# EAGLE schematic iomodul3 (EAGLE 6.6.0)
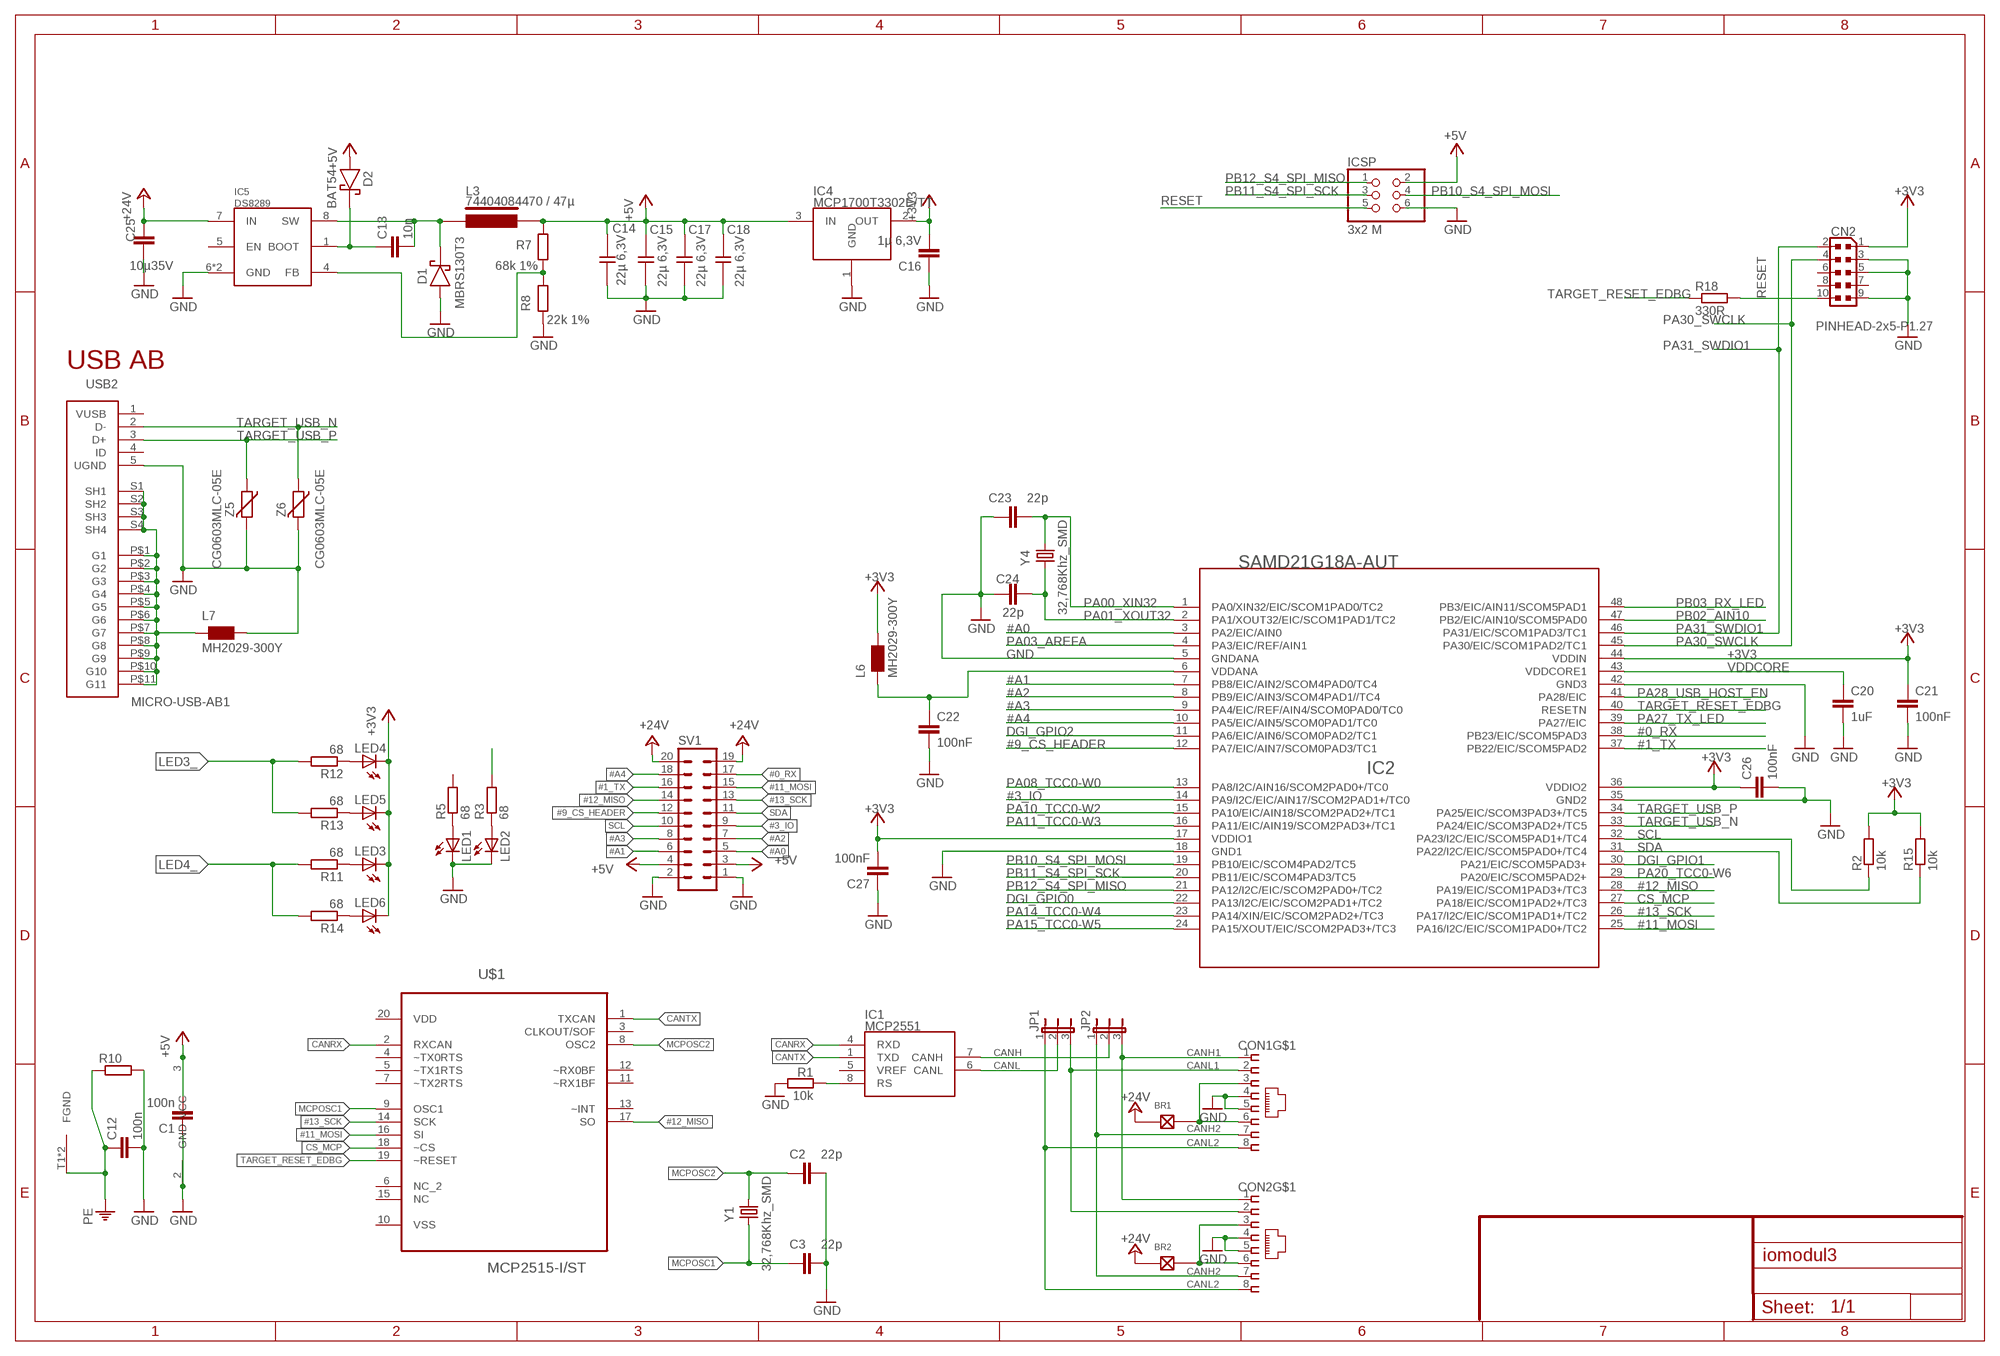
[diagram p0: schematic, sheet 1]

## Parts
BR1  LÖTBRÜCKE-S  [LÖTBRÜCKE]
BR2  LÖTBRÜCKE-S  [LÖTBRÜCKE]
C1  100n  C-EUC0805  [C0805]
C2  22p  C-EUC0805  [C0805]
C3  22p  C-EUC0805  [C0805]
C12  100n  C-EUC0805  [C0805]
C13  10n  C-EUC0805  [C0805]
C14  22µ 6,3V  CAP1210  [1210]
C15  22µ 6,3V  CAP1210  [1210]
C16  1µ 6,3V  C-EUC1206  [C1206]
C17  22µ 6,3V  CAP1210  [1210]
C18  22µ 6,3V  CAP1210  [1210]
C20  1uF  C-EUC0805  [C0805]
C21  100nF  C-EUC0805  [C0805]
C22  100nF  C-EUC0805  [C0805]
C23  22p  C-EUC0805  [C0805]
C24  22p  C-EUC0805  [C0805]
C25  10µ35V  C-EUC0805  [C0805]
C26  100nF  C-EUC0805  [C0805]
C27  100nF  C-EUC0805  [C0805]
CN2  PINHEAD-2x5-P1.27  0171_PH127-205DF055G00A  [PINHEAD-2X5-P127]
CON1  MEBP_8-8G  [MEBP]
CON2  MEBP_8-8G  [MEBP]
D1  MBRS130T3  [SMB]
D2  BAT54  [SOT23/32]
IC1  MCP2551  [SO-8]
IC2  SAMD21G18A-AUT  1792_SAMD21G18A-AUT  [TQFP48-7X7]
IC4  MCP1700T3302E/TT  MCP1700  [SOT23]
IC5  DS8289  [SO8-POWERPAD]
ICSP  3x2 M  0114_PH254-203DF118A00V  [2X03]
JP1  JP2E  [JP2]
JP2  JP2E  [JP2]
L3  74404084470 / 47µ  WE-LQS  [WE-LQS]
L6  MH2029-300Y  0001_BLM21PG300SN1D_/_MH2029-300Y  [0805]
L7  MH2029-300Y  0001_BLM21PG300SN1D_/_MH2029-300Y  [0805]
LED1  LEDCHIPLED_0805  [CHIPLED_0805]
LED2  LEDCHIPLED_0805  [CHIPLED_0805]
LED3  LEDCHIPLED_0805  [CHIPLED_0805]
LED4  LEDCHIPLED_0805  [CHIPLED_0805]
LED5  LEDCHIPLED_0805  [CHIPLED_0805]
LED6  LEDCHIPLED_0805  [CHIPLED_0805]
R1  10k  R-EU_R0805  [R0805]
R2  10k  R-EU_R0805  [R0805]
R3  68  R-EU_R0805  [R0805]
R5  68  R-EU_R0805  [R0805]
R7  68k 1%  R-EU_R0805  [R0805]
R8  22k 1%  R-EU_R0805  [R0805]
R10  R-EU_R0805  [R0805]
R11  68  R-EU_R0805  [R0805]
R12  68  R-EU_R0805  [R0805]
R13  68  R-EU_R0805  [R0805]
R14  68  R-EU_R0805  [R0805]
R15  10k  R-EU_R0805  [R0805]
R18  330R  R-EU_R0805  [R0805]
SV1  MA10-2  [MA10-2]
U$1  MCP2515-I/ST  [SOP65P640X110-20N]
USB2  MICRO-USB-AB1  0631_MCR-AB1-S-RA-SMT-TR  [MCR-AB1-S-RA-SMT]
Y1  32,768Khz_SMD  0213_ABS07-32.768KHZ-T  [RESONATOR_EPSON_FC_145]
Y4  32,768Khz_SMD  0213_ABS07-32.768KHZ-T  [RESONATOR_EPSON_FC_145]
Z5  CG0603MLC-05E  0010_BRNCG0603MLC-05E  [CT/CN0603]
Z6  CG0603MLC-05E  0010_BRNCG0603MLC-05E  [CT/CN0603]

## Nets
#0_RX: IC2.38(PB23/EIC/SCOM5PAD3) SV1.17
#1_TX: IC2.37(PB22/EIC/SCOM5PAD2) SV1.16
#3_IO: IC2.14(PA9/I2C/EIC/AIN17/SCOM2PAD1+/TC0) SV1.9
#9_CS_HEADER: IC2.12(PA7/EIC/AIN7/SCOM0PAD3/TC1) SV1.12
#11_MOSI: IC2.25(PA16/I2C/EIC/SCOM1PAD0+/TC2) SV1.15 U$1.16(SI)
#12_MISO: IC2.28(PA19/EIC/SCOM1PAD3+/TC3) SV1.14 U$1.17(SO)
#13_SCK: IC2.26(PA17/I2C/EIC/SCOM1PAD1+/TC2) SV1.13 U$1.14(SCK)
#A0: IC2.3(PA2/EIC/AIN0) SV1.5
#A1: IC2.7(PB8/EIC/AIN2/SCOM4PAD0/TC4) SV1.6
#A2: IC2.8(PB9/EIC/AIN3/SCOM4PAD1//TC4) SV1.7
#A3: IC2.9(PA4/EIC/REF/AIN4/SCOM0PAD0/TC0) SV1.8
#A4: IC2.10(PA5/EIC/AIN5/SCOM0PAD1/TC0) SV1.18
+3V3: C16.2 C21.1 C26.1 C27.2 CN2.1 IC2.17(VDDIO1) IC2.36(VDDIO2) IC2.44(VDDIN) IC4.2(OUT) L6.2 LED3.C LED4.C LED5.C LED6.C R2.2 R15.2
+5V: C1.2 C14.2 C15.2 C17.2 C18.2 D2.1(A) IC1.3(VCC) IC4.3(IN) ICSP.2 L3.P$2 R7.2 SV1.3 SV1.4
+24V: BR1.1 BR2.1 C25.2 IC5.7(IN) SV1.19 SV1.20
CANH: IC1.7(CANH) JP2.2
CANH1: CON1.1 CON2.1 JP2.3
CANH2: CON1.7 CON2.7 JP2.1
CANL: IC1.6(CANL) JP1.2
CANL1: CON1.2 CON2.2 JP1.3
CANL2: CON1.8 CON2.8 JP1.1
CANRX: IC1.4(RXD) U$1.2(RXCAN)
CANTX: IC1.1(TXD) U$1.1(TXCAN)
CS_MCP: IC2.27(PA18/EIC/SCOM1PAD2+/TC3) U$1.18(~CS)
DGI_GPIO0: IC2.22(PA13/I2C/EIC/SCOM2PAD1+/TC2)
DGI_GPIO1: IC2.30(PA21/EIC/SCOM5PAD3+)
DGI_GPIO2: IC2.11(PA6/EIC/AIN6/SCOM0PAD2/TC1)
GND: C1.1 C2.2 C3.2 C12.2 C14.1 C15.1 C16.1 C17.1 C18.1 C20.2 C21.2 C22.2 C23.1 C24.1 C25.1 C26.2 C27.1 CN2.3 CN2.5 CN2.9 CON1.4 CON1.5 CON2.4 CON2.5 D1.A IC1.2(GND) IC2.5(GNDANA) IC2.18(GND1) IC2.35(GND2) IC2.42(GND3) IC4.1(GND) IC5.6(GND) IC5.TP(GND) ICSP.6 L7.2 LED1.C LED2.C R1.2 R8.1 R10.2 SV1.1 SV1.2 USB2.5(UGND) Z5.2 Z6.2
LED2: R3.2
LED3_: R12.2 R13.2
LED4_: R11.2 R14.2
MCPOSC1: C3.1 U$1.9(OSC1) Y1.P$1
MCPOSC2: C2.1 U$1.8(OSC2) Y1.P$2
N$1: IC1.8(RS) R1.1
N$2: BR1.2 CON1.3 CON1.6
N$3: LED2.A R3.1
N$4 [gnd]: L7.1 USB2.P$1(G1) USB2.P$2(G2) USB2.P$3(G3) USB2.P$4(G4) USB2.P$5(G5) USB2.P$6(G6) USB2.P$7(G7) USB2.P$8(G8) USB2.P$9(G9) USB2.P$10(G10) USB2.P$11(G11) USB2.S1(SH1) USB2.S2(SH2) USB2.S3(SH3) USB2.S4(SH4)
N$6: BR2.2 CON2.3 CON2.6
N$7: LED1.A R5.1
N$8: LED5.A R13.1
N$9: LED6.A R14.1
N$10: LED4.A R12.1
N$11: LED3.A R11.1
N$12: C13.1 D2.3(K) IC5.1(BOOT)
N$13: C13.2 D1.K IC5.8(SW) L3.P$1
N$15: C22.1 IC2.6(VDDANA) L6.1
N$18: IC5.4(FB) R7.1 R8.2
PA00_XIN32: C23.2 IC2.1(PA0/XIN32/EIC/SCOM1PAD0/TC2) Y4.P$2
PA01_XOUT32: C24.2 IC2.2(PA1/XOUT32/EIC/SCOM1PAD1/TC2) Y4.P$1
PA03_AREFA: IC2.4(PA3/EIC/REF/AIN1)
PA08_TCC0-W0: IC2.13(PA8/I2C/AIN16/SCOM2PAD0+/TC0)
PA10_TCC0-W2: IC2.15(PA10/EIC/AIN18/SCOM2PAD2+/TC1)
PA11_TCC0-W3: IC2.16(PA11/EIC/AIN19/SCOM2PAD3+/TC1)
PA14_TCC0-W4: IC2.23(PA14/XIN/EIC/SCOM2PAD2+/TC3)
PA15_TCC0-W5: IC2.24(PA15/XOUT/EIC/SCOM2PAD3+/TC3)
PA20_TCC0-W6: IC2.29(PA20/EIC/SCOM5PAD2+)
PA27_TX_LED: IC2.39(PA27/EIC)
PA28_USB_HOST_EN: IC2.41(PA28/EIC)
PA30_SWCLK: CN2.4 IC2.45(PA30/EIC/SCOM1PAD2/TC1)
PA31_SWDIO1: CN2.2 IC2.46(PA31/EIC/SCOM1PAD3/TC1)
PB02_AIN10: IC2.47(PB2/EIC/AIN10/SCOM5PAD0)
PB03_RX_LED: IC2.48(PB3/EIC/AIN11/SCOM5PAD1)
PB10_S4_SPI_MOSI: IC2.19(PB10/EIC/SCOM4PAD2/TC5) ICSP.4
PB11_S4_SPI_SCK: IC2.20(PB11/EIC/SCOM4PAD3/TC5) ICSP.3
PB12_S4_SPI_MISO: IC2.21(PA12/I2C/EIC/SCOM2PAD0+/TC2) ICSP.1
PE: C12.1 CON1.T1(FGND) CON1.T2(FGND) R10.1
RESET: CN2.10 ICSP.5 R18.2
SCL: IC2.32(PA23/I2C/EIC/SCOM5PAD1+/TC4) R2.1 SV1.10
SDA: IC2.31(PA22/I2C/EIC/SCOM5PAD0+/TC4) R15.1 SV1.11
TARGET_RESET_EDBG: IC2.40(RESETN) R18.1 U$1.19(~RESET)
TARGET_USB_N [USBpair]: IC2.33(PA24/EIC/SCOM3PAD2+/TC5) USB2.2(D-) Z6.1
TARGET_USB_P [USBpair]: IC2.34(PA25/EIC/SCOM3PAD3+/TC5) USB2.3(D+) Z5.1
VDDCORE: C20.1 IC2.43(VDDCORE1)
Unconnected: CN2.6 CN2.7 CN2.8 IC1.5(VREF) IC5.5(EN) R5.2 U$1.3(CLKOUT/SOF) U$1.4(~TX0RTS) U$1.5(~TX1RTS) U$1.6(NC_2) U$1.7(~TX2RTS) U$1.11(~RX1BF) U$1.12(~RX0BF) U$1.13(~INT) U$1.15(NC) USB2.4(ID)

## Notes on the sheet
- USB AB

## Power pins joined to a net without a drawn wire
FGND: CON2.T1(FGND) CON2.T2(FGND)
VDD: U$1.20(VDD)
VSS: U$1.10(VSS)
VUSB: USB2.1(VUSB)

## Library data of the parts
BR1 BR2 = myspecial:LÖTBRÜCKE
C1-C3 C12 C13 C16 C20-C27 = schlager_passiv:C-EU: CAPACITOR, European symbol
C14 C15 C17 C18 = MYPASS:CAP1210
CN2 = Connettori:0171_PH127-205DF055G00A: 2x5 PASSO 1,27
CON1 CON2 = myconn:MEBP_8-8G: Reichelt RJ45 geschirmt MEBP 8-8G
D1 = MYDISCR:MBRS130T3
D2 = MYDISCR:BAT54
IC1 = MYMCHIP:MCP2551: CAN Transceiver
IC2 = IntegratedCircuits:1792_SAMD21G18A-AUT: Atmel D21 32bit ARM Cortex-M0 microcontroller - 48 PIN TQFP 256KB flash memory + 32KB SRAM
IC4 = MYMCHIP:MCP1700: LDO 250mA
IC5 = MYRichtek:DS8289
ICSP = Connettori:0114_PH254-203DF118A00V: 3x2 M V h 8,5 mm p2,54; MONTHLY_USAGE: _____; PART_NUMBER: PH254-203DF118A00V; PRICE: _____; SUPPLIER: _____; TYPE: Connettori; VALUE: ICSP
JP1 JP2 = jumper:JP2E: JUMPER
L3 = myinductiv:WE-LQS
L6 L7 = Protezione:0001_BLM21PG300SN1D_/_MH2029-300Y: BLM21; MONTHLY_USAGE: _____; PART_NUMBER: BLM21PG300SN1D_/_MH2029-300Y; PRICE: _____; SUPPLIER: _____; TYPE: Protezione
LED1-LED6 = led:LED: LED OSRAM: - CHIPLED LG R971, LG N971, LY N971, LG Q971, LY Q971, LO R971, LY R971 LH N974, LH R974 LS Q976, LO Q976, LY Q976 LO Q996 - Hyper CHIPLED LW Q18S LB Q993, LB Q99A, LB R99A - SideLED LS A670, LO A670, LY A670, LG A670, LP A670 LB A673, LV A673, LT A673, LW A673 LH A674 LY A675 LS A676, LA A676, LO A676, LY A676, LW A676 LS A679, LY A679, LG A679 - Hyper Micro SIDELED® LS Y876, LA Y876, LO Y876, LY Y876 LT Y87S - SmartLED LW L88C, LW L88S LB L89C, LB L89S, LG L890 LS L89K, LO L89K, LY L89K LS L896, LA L896, LO L896, LY L896 - TOPLED LS T670, LO T670, LY T670, LG T670, LP T670 LSG T670, LSP T670, LSY T670, LOP T670, LYG T670 LG T671, LOG T671, LSG T671 LB T673, LV T673, LT T673, LW T673 LH T674 LS T676, LA T676, LO T676, LY T676, LB T676, LH T676, LSB T676, LW T676 LB T67C, LV T67C, LT T67C, LS T67K, LO T67K, LY T67K, LW E67C LS E67B, LA E67B, LO E67B, LY E67B, LB E67C, LV E67C, LT E67C LW T67C LS T679, LY T679, LG T679 LS T770, LO T770, LY T770, LG T770, LP T770 LB T773, LV T773, LT T773, LW T773 LH T774 LS E675, LA E675, LY E675, LS T675 LS T776, LA T776, LO T776, LY T776, LB T776 LHGB T686 LT T68C, LB T68C - Hyper Mini TOPLED® LB M676 - Mini TOPLED Santana® LG M470 LS M47K, LO M47K, LY M47K Source: http://www.osram.convergy.de LUXEON: - LUMILED® LXK2-PW12-R00, LXK2-PW12-S00, LXK2-PW14-U00, LXK2-PW14-V00 LXK2-PM12-R00, LXK2-PM12-S00, LXK2-PM14-U00 LXK2-PE12-Q00, LXK2-PE12-R00, LXK2-PE12-S00, LXK2-PE14-T00, LXK2-PE14-U00 LXK2-PB12-K00, LXK2-PB12-L00, LXK2-PB12-M00, LXK2-PB14-N00, LXK2-PB14-P00, LXK2-PB14-Q00 LXK2-PR12-L00, LXK2-PR12-M00, LXK2-PR14-Q00, LXK2-PR14-R00 LXK2-PD12-Q00, LXK2-PD12-R00, LXK2-PD12-S00 LXK2-PH12-R00, LXK2-PH12-S00 LXK2-PL12-P00, LXK2-PL12-Q00, LXK2-PL12-R00 Source: www.luxeon.com KINGBRIGHT: KA-3528ASYC Source: www.kingbright.com
R1-R3 R5 R7 R8 R10-R15 R18 = schlager_passiv:R-EU_: RESISTOR, European symbol
SV1 = con-lstb:MA10-2: PIN HEADER; OC_FARNELL: unknown; OC_NEWARK: unknown
U$1 = CHIP_MCP:MCP2515-I/ST: Stand-Alone CAN Controller; MPN: MCP2515-I/ST; OC_FARNELL: 1196851; OC_NEWARK: 61K2946; PACKAGE: SOP-20; SUPPLIER: Microchip
USB2 = Connettori:0631_MCR-AB1-S-RA-SMT-TR: Usb Micro F/90 Smd Tipo AB; MONTHLY_USAGE: _____; PART_NUMBER: MCR-AB1-S-RA-SMT-TR; PRICE: _____; SUPPLIER: _____; TYPE: Connettori; VALUE: MCR-AB1-S-RA-SMT-TR
Y1 Y4 = Cristalli:0213_ABS07-32.768KHZ-T: 32,768KHz - SMD; MONTHLY_USAGE: _____; PART_NUMBER: ABS07-32.768KHZ-T; PRICE: _____; SUPPLIER: _____; TYPE: Cristalli
Z5 Z6 = Protezione:0010_BRNCG0603MLC-05E: CG0603MLC-05E; MONTHLY_USAGE: _____; PART_NUMBER: BRNCG0603MLC-05E; PRICE: _____; SUPPLIER: _____; TYPE: Protezione; VALUE: BRNCG0603MLC-05E

## Net classes
0 default: width 0.203 mm, drill 0.203 mm, clearance 0.178 mm
2 gnd: width 0.254 mm, drill 0.254 mm, clearance 0.178 mm
3 usbvcc: width 0.203 mm, drill 0.406 mm, clearance 0.178 mm
4 USBpair: width 0.254 mm, drill 0.406 mm, clearance 0.508 mm